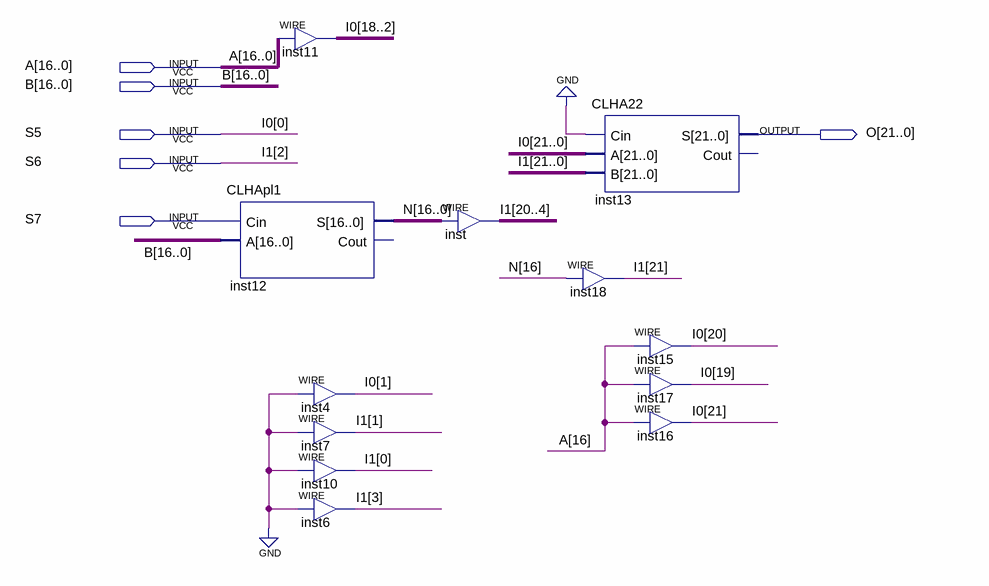
[diagram p0: schematic sheet]
// Quartus schematic R6R7.bdf as structural Verilog: 12 symbols, 6 pins
module R6R7 (
  input  [16:0] A,
  input  [16:0] B,
  input  S5,
  input  S6,
  input  S7,
  output [21:0] O
);

  wire [16:0] N;
  wire [21:0] I1;
  wire [21:1] I0;

  CLHApl1 inst12 (.Cin(S7), .A(B), .S(N));  // open: Cout
  assign I0[18:2] = A;  // WIRE inst11
  assign I0[1] = 1'b0;  // WIRE inst4
  assign I1[1] = 1'b0;  // WIRE inst7
  assign I1[0] = 1'b0;  // WIRE inst10
  assign I1[3] = 1'b0;  // WIRE inst6
  assign I1[20:4] = N;  // WIRE inst
  assign I1[21] = N[16];  // WIRE inst18
  CLHA22 inst13 (.Cin(1'b0), .A({I0, S5}), .B({I1[21:3], S6, I1[1:0]}), .S(O));  // open: Cout
  assign I0[20] = A[16];  // WIRE inst15
  assign I0[19] = A[16];  // WIRE inst17
  assign I0[21] = A[16];  // WIRE inst16

  // Other names for the same wires on the sheet: I0[0] = S5; I1[2] = S6
endmodule
